# Altium schematic sheet ESIMA E-Meter_RS232.SchDoc: Esima RS232
size A3; DrawnBy: Jürgen Merz; Address1: Wilhelm- Schickard- Strasse 10; Address2: 78052 Villingen Schwenningen; Address3: juergen.merz@hsg-imit.de; Address4: Tel. +49 7721 943 138; PhoneNumber: +49 7721 943 138; FaxNumber: +49 7721 943 140
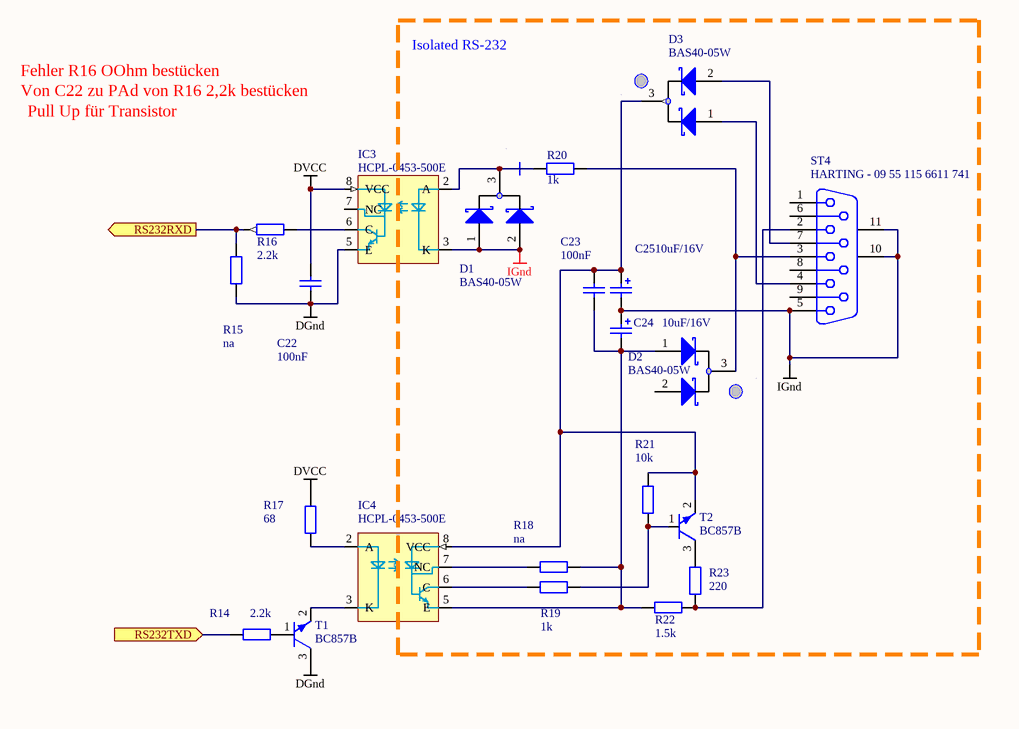
[diagram p0: ESIMA E-Meter_RS232.SchDoc]

## Parts
C22  100nF  [CAPC1608N]
C23  100nF  [CAPC1608N]
C24  10uF/16V  [Cap Tant Pol Form A]
C25  10uF/16V  [Cap Tant Pol Form A]
D1  BAS40-05W  [SOT-323N (SC-70)]
D2  BAS40-05W  [SOT-323N (SC-70)]
D3  BAS40-05W  [SOT-323N (SC-70)]
IC3  HCPL-0453-500E  [SOIC127P600-8N]
IC4  HCPL-0453-500E  [SOIC127P600-8N]
R14  2.2k  [RESC1608N]
R15  na  [RESC1608N]
R16  2.2k  [RESC1608N]
R17  68  [RESC1608N]
R18  na
R19  1k  [RESC1608N]
R20  1k  [RESC1608N]
R21  10k  [RESC1608N]
R22  1.5k  [RESC1608N]
R23  220  [RESC1608N]
ST4  HARTING - 09 55 115 6611 741  [Harting D-SUB SMT 9 poles]
T1  BC857B  [SOT23-3N]
T2  BC857B  [SOT23-3N]

## Blocks framed on the sheet
Isolated RS-232: C23-C25 D1-D3 IC4 R18-R23 ST4 T2

## Ports
RS232RXD (out), RS232TXD (in)

## Nets
DGnd: C22.1 IC3.5(E) R15.2 T1.3(D)
DVCC: C22.2 IC3.8(VCC) R17.1
IGnd: C24.1 C25.2 D1.1(A1) D1.2(A2) IC3.3(K) ST4.5 ST4.10(MH1) ST4.11(MH2)
RS232RXD: R15.1 R16.2 ; port RS232RXD
RS232TXD: R14.2 ; port RS232TXD
NetC23_1: C23.1 C24.2 D2.1(A1) IC4.5(E) R18.1 R22.1
NetC23_2: C23.2 C25.1 D3.3(K) IC4.8(VCC) R21.1 T2.2(S)
NetD1_3: D1.3(K) IC3.2(A) R20.2
NetD2_3: D2.3(K) R20.1 ST4.3
NetD3_1: D3.1(A1) ST4.4
NetD3_2: D3.2(A2) ST4.7
NetIC3_6: IC3.6(C) R16.1
NetIC4_2: IC4.2(A) R17.2
NetIC4_3: IC4.3(K) T1.2(S)
NetIC4_6: IC4.6(C) R19.2
NetIC4_7: IC4.7(NC) R18.2
NetR14_1: R14.1 T1.1(G)
NetR19_1: R19.1 R21.2 T2.1(G)
NetR22_2: R22.2 R23.2 ST4.2
NetR23_1: R23.1 T2.3(D)

Not connected (* = marked no-connect by the designer): D2 2(A2); IC3 1(NC) 4(NC) 7(NC); IC4 1(NC) 4(NC); ST4 1 6 8 9

## Notes on the sheet
- Fehler R16 OOhm bestücken
- Von C22 zu PAd von R16 2,2k bestücken
- Pull Up für Transistor
- Title
- Size:
- Date:
- A3
- Number:
- Time:
- Revision:
- Sheet
- of
- File:

## Library data of the parts
C22 C23 = CAPC1608 (C0603): Supplier 1: Farnell; Supplier Part Number 1: 1657913
C24 C25 = Cap Tant Pol Form A: Supplier 1: Farnell; Supplier Part Number 1: 9227873RL
D1-D3 = BAS40-05W: Diode Schottky Dual SOT-323 (SC70); Supplier 1: Farnell; Supplier Part Number 1: 8734330
IC3 IC4 = PS8802: High Speed Optocoupler SO8; Supplier 1: Mouser; Supplier Part Number 1: 630-HCPL-0453-500E
R14-R23 = RESC1608 (R0603)
  R14 R16: Supplier 1: Farnell; Supplier Part Number 1: 2008338
  R17: Supplier 1: Farnell; Supplier Part Number 2: 2333615
  R18 R19: Supplier 1: Farnell; Supplier Part Number 1: 2008335
  R21: Supplier 1: Farnell; Supplier Part Number 1: 2008341
  R22: Supplier 1: Farnell; Supplier Part Number 1: 2333563
  R23: Supplier 1: Farnell; Supplier Part Number 1: 2333535
ST4 = D Connector 9: HARTING - 09 55 115 6611 741 - D-SUB, BUCHSE, SMT, M3, 9POL; Supplier 1: Farnell; Supplier Part Number 1: 2356655
T1 T2 = Transistor PNP SOT-23: Supplier 1: Farnell; Supplier Part Number 1: 1798069